# EAGLE schematic csa_ultrabus_v2 (EAGLE 6.4)

## Sheet 1 of 5: CS/A BUS
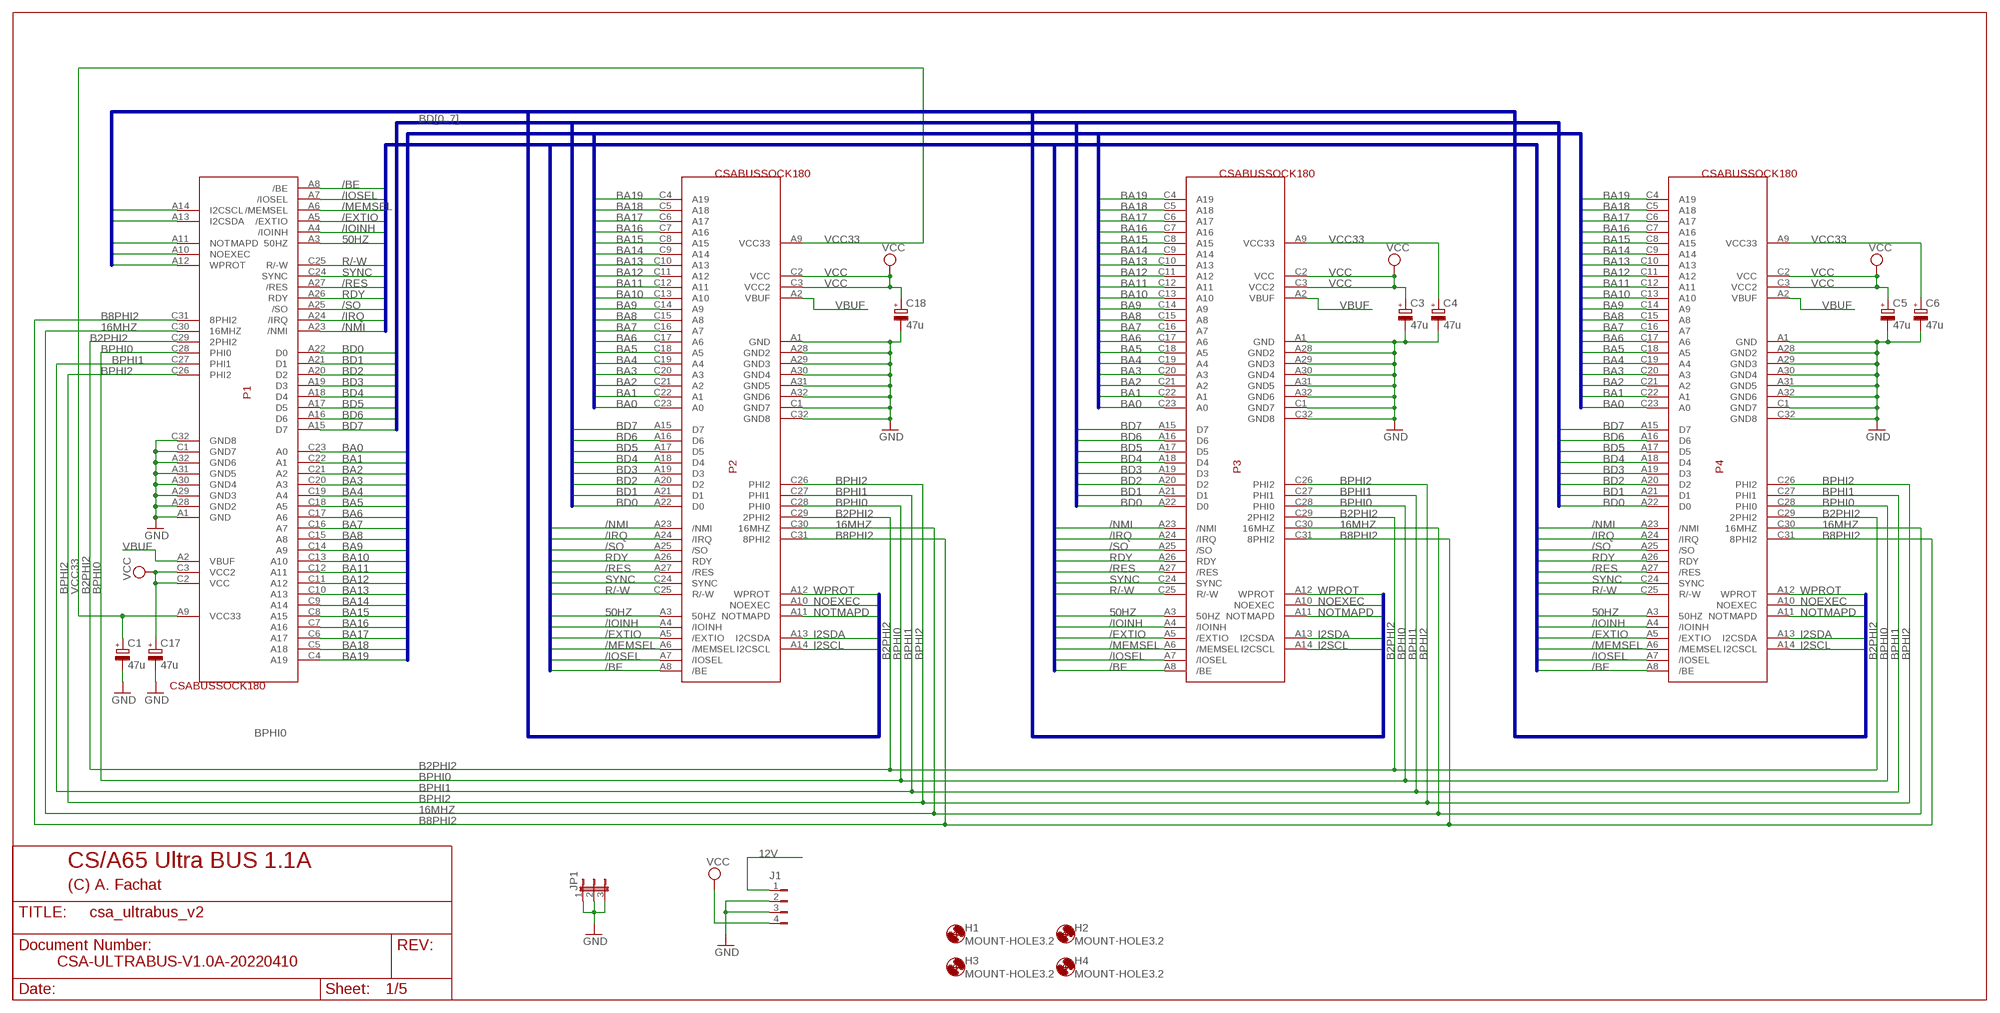
[diagram p0: schematic, sheet 1]

### Parts
C1  47u  CPOL-EUE2.5-5  [E2,5-5]
C3  47u  CPOL-EUE2.5-5  [E2,5-5]
C4  47u  CPOL-EUE2.5-5  [E2,5-5]
C5  47u  CPOL-EUE2.5-5  [E2,5-5]
C6  47u  CPOL-EUE2.5-5  [E2,5-5]
C17  47u  CPOL-EUE2.5-5  [E2,5-5]
C18  47u  CPOL-EUE2.5-5  [E2,5-5]
H1  MOUNT-HOLE3.2  [3,2]
H2  MOUNT-HOLE3.2  [3,2]
H3  MOUNT-HOLE3.2  [3,2]
H4  MOUNT-HOLE3.2  [3,2]
J1  FLOP-4W827001  [827001]
JP1  JP2E  [JP2]
P1  CSABUSSOCK180  [CSABUSSOCK180]
P2  CSABUSSOCK180  [CSABUSSOCK180]
P3  CSABUSSOCK180  [CSABUSSOCK180]
P4  CSABUSSOCK180  [CSABUSSOCK180]

### Nets
12V: J1.1 ; also sheet 2
16MHZ: P1.C30(16MHZ) P2.C30(16MHZ) P3.C30(16MHZ) P4.C30(16MHZ)
50HZ: P1.A3(50HZ) P2.A3(50HZ) P3.A3(50HZ) P4.A3(50HZ)
/BE: P1.A8(/BE) P2.A8(/BE) P3.A8(/BE) P4.A8(/BE) ; also sheet 2,5
/EXTIO: P1.A5(/EXTIO) P2.A5(/EXTIO) P3.A5(/EXTIO) P4.A5(/EXTIO)
/IOINH: P1.A4(/IOINH) P2.A4(/IOINH) P3.A4(/IOINH) P4.A4(/IOINH) ; also sheet 2
/IOSEL: P1.A7(/IOSEL) P2.A7(/IOSEL) P3.A7(/IOSEL) P4.A7(/IOSEL) ; also sheet 2,5
/IRQ: P1.A24(/IRQ) P2.A24(/IRQ) P3.A24(/IRQ) P4.A24(/IRQ) ; also sheet 2,3,4,5
/MEMSEL: P1.A6(/MEMSEL) P2.A6(/MEMSEL) P3.A6(/MEMSEL) P4.A6(/MEMSEL) ; also sheet 2,5
/NMI: P1.A23(/NMI) P2.A23(/NMI) P3.A23(/NMI) P4.A23(/NMI) ; also sheet 2,4,5
/RES: P1.A27(/RES) P2.A27(/RES) P3.A27(/RES) P4.A27(/RES) ; also sheet 2,3,4,5
/SO: P1.A25(/SO) P2.A25(/SO) P3.A25(/SO) P4.A25(/SO)
B2PHI2: P1.C29(2PHI2) P2.C29(2PHI2) P3.C29(2PHI2) P4.C29(2PHI2) ; also sheet 2,5
B8PHI2: P1.C31(8PHI2) P2.C31(8PHI2) P3.C31(8PHI2) P4.C31(8PHI2) ; also sheet 2,4,5
BA0: P1.C23(A0) P2.C23(A0) P3.C23(A0) P4.C23(A0) ; also sheet 2,3,4,5
BA1: P1.C22(A1) P2.C22(A1) P3.C22(A1) P4.C22(A1) ; also sheet 2,3,4,5
BA2: P1.C21(A2) P2.C21(A2) P3.C21(A2) P4.C21(A2) ; also sheet 2,3,4,5
BA3: P1.C20(A3) P2.C20(A3) P3.C20(A3) P4.C20(A3) ; also sheet 2,3,4,5
BA4: P1.C19(A4) P2.C19(A4) P3.C19(A4) P4.C19(A4) ; also sheet 2,3,4,5
BA5: P1.C18(A5) P2.C18(A5) P3.C18(A5) P4.C18(A5) ; also sheet 2,3,4,5
BA6: P1.C17(A6) P2.C17(A6) P3.C17(A6) P4.C17(A6) ; also sheet 2,3,4,5
BA7: P1.C16(A7) P2.C16(A7) P3.C16(A7) P4.C16(A7) ; also sheet 2,3,4,5
BA8: P1.C15(A8) P2.C15(A8) P3.C15(A8) P4.C15(A8) ; also sheet 2,3,4,5
BA9: P1.C14(A9) P2.C14(A9) P3.C14(A9) P4.C14(A9) ; also sheet 2,3,4,5
BA10: P1.C13(A10) P2.C13(A10) P3.C13(A10) P4.C13(A10) ; also sheet 2,3,4,5
BA11: P1.C12(A11) P2.C12(A11) P3.C12(A11) P4.C12(A11) ; also sheet 2,3,4,5
BA12: P1.C11(A12) P2.C11(A12) P3.C11(A12) P4.C11(A12) ; also sheet 2,3,4,5
BA13: P1.C10(A13) P2.C10(A13) P3.C10(A13) P4.C10(A13) ; also sheet 2,3,4,5
BA14: P1.C9(A14) P2.C9(A14) P3.C9(A14) P4.C9(A14) ; also sheet 2,3,4,5
BA15: P1.C8(A15) P2.C8(A15) P3.C8(A15) P4.C8(A15) ; also sheet 2,3,4,5
BA16: P1.C7(A16) P2.C7(A16) P3.C7(A16) P4.C7(A16) ; also sheet 2,5
BA17: P1.C6(A17) P2.C6(A17) P3.C6(A17) P4.C6(A17) ; also sheet 2,5
BA18: P1.C5(A18) P2.C5(A18) P3.C5(A18) P4.C5(A18) ; also sheet 2,5
BA19: P1.C4(A19) P2.C4(A19) P3.C4(A19) P4.C4(A19) ; also sheet 2,5
BD0: P1.A22(D0) P2.A22(D0) P3.A22(D0) P4.A22(D0) ; also sheet 2,3,4,5
BD1: P1.A21(D1) P2.A21(D1) P3.A21(D1) P4.A21(D1) ; also sheet 2,3,4,5
BD2: P1.A20(D2) P2.A20(D2) P3.A20(D2) P4.A20(D2) ; also sheet 2,3,4,5
BD3: P1.A19(D3) P2.A19(D3) P3.A19(D3) P4.A19(D3) ; also sheet 2,3,4,5
BD4: P1.A18(D4) P2.A18(D4) P3.A18(D4) P4.A18(D4) ; also sheet 2,3,4,5
BD5: P1.A17(D5) P2.A17(D5) P3.A17(D5) P4.A17(D5) ; also sheet 2,3,4,5
BD6: P1.A16(D6) P2.A16(D6) P3.A16(D6) P4.A16(D6) ; also sheet 2,3,4,5
BD7: P1.A15(D7) P2.A15(D7) P3.A15(D7) P4.A15(D7) ; also sheet 2,3,4,5
BPHI0: P1.C28(PHI0) P2.C28(PHI0) P3.C28(PHI0) P4.C28(PHI0) ; also sheet 5
BPHI1: P1.C27(PHI1) P2.C27(PHI1) P3.C27(PHI1) P4.C27(PHI1) ; also sheet 2,5
BPHI2: P1.C26(PHI2) P2.C26(PHI2) P3.C26(PHI2) P4.C26(PHI2) ; also sheet 2,3,4,5
GND: C1.- C3.- C4.- C5.- C6.- C17.- C18.- J1.2 J1.3 JP1.1 JP1.2 JP1.3 P1.A1(GND) P1.A28(GND2) P1.A29(GND3) P1.A30(GND4) P1.A31(GND5) P1.A32(GND6) P1.C1(GND7) P1.C32(GND8) P2.A1(GND) P2.A28(GND2) P2.A29(GND3) P2.A30(GND4) P2.A31(GND5) P2.A32(GND6) P2.C1(GND7) P2.C32(GND8) P3.A1(GND) P3.A28(GND2) P3.A29(GND3) P3.A30(GND4) P3.A31(GND5) P3.A32(GND6) P3.C1(GND7) P3.C32(GND8) P4.A1(GND) P4.A28(GND2) P4.A29(GND3) P4.A30(GND4) P4.A31(GND5) P4.A32(GND6) P4.C1(GND7) P4.C32(GND8) ; also sheet 2,3,4,5
I2SCL: P1.A14(I2CSCL) P2.A14(I2CSCL) P3.A14(I2CSCL) P4.A14(I2CSCL)
I2SDA: P1.A13(I2CSDA) P2.A13(I2CSDA) P3.A13(I2CSDA) P4.A13(I2CSDA)
NOEXEC: P1.A10(NOEXEC) P2.A10(NOEXEC) P3.A10(NOEXEC) P4.A10(NOEXEC)
NOTMAPD: P1.A11(NOTMAPD) P2.A11(NOTMAPD) P3.A11(NOTMAPD) P4.A11(NOTMAPD)
R/-W: P1.C25(R/-W) P2.C25(R/-W) P3.C25(R/-W) P4.C25(R/-W) ; also sheet 2,3,4,5
RDY: P1.A26(RDY) P2.A26(RDY) P3.A26(RDY) P4.A26(RDY) ; also sheet 2,5
SYNC: P1.C24(SYNC) P2.C24(SYNC) P3.C24(SYNC) P4.C24(SYNC) ; also sheet 2,3,5
VBUF: P1.A2(VBUF) P2.A2(VBUF) P3.A2(VBUF) P4.A2(VBUF) ; also sheet 5
VCC: C3.+ C5.+ C17.+ C18.+ J1.4 P1.C2(VCC) P1.C3(VCC2) P2.C2(VCC) P2.C3(VCC2) P3.C2(VCC) P3.C3(VCC2) P4.C2(VCC) P4.C3(VCC2) ; also sheet 2,3,4,5
VCC33: C1.+ C4.+ C6.+ P1.A9(VCC33) P2.A9(VCC33) P3.A9(VCC33) P4.A9(VCC33) ; also sheet 5
WPROT: P1.A12(WPROT) P2.A12(WPROT) P3.A12(WPROT) P4.A12(WPROT)

### Buses
BD[0..7]
BA[0..19]
/BE,/IOSEL,/MEMSEL,/EXTIO,/IOINH,50HZ,R/-W,SYNC,/RES,RDY,/SO,/IRQ,/NMI
I2SCL,I2SDA,NOTMAPD,NOEXEC,WPROT

### Notes on the sheet
- CS/A65 Ultra BUS 1.1A
- (C) A. Fachat
- CSA-ULTRABUS-V1.0A-20220410

## Sheet 2 of 5: Apple II Bus
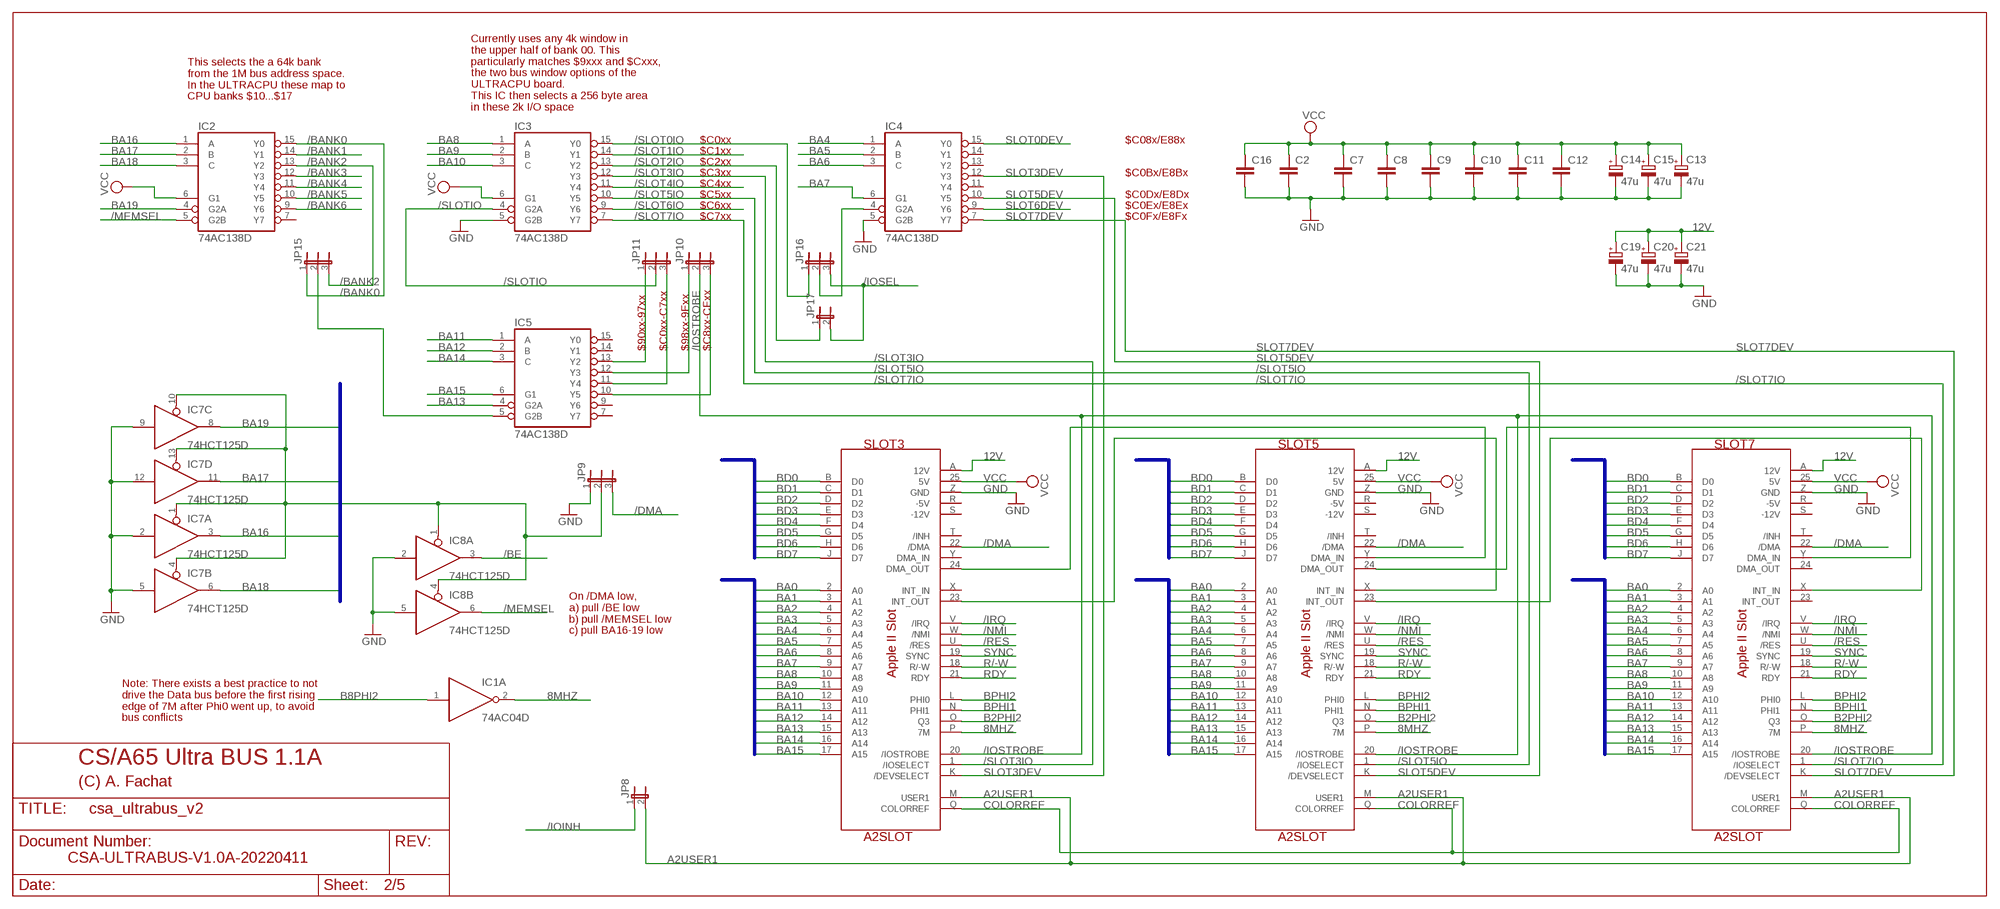
[diagram p1: schematic, sheet 2]

### Parts
C2  C-EUC0603  [C0603]
C7  C-EUC0603  [C0603]
C8  C-EUC0603  [C0603]
C9  C-EUC0603  [C0603]
C10  C-EUC0603  [C0603]
C11  C-EUC0603  [C0603]
C12  C-EUC0603  [C0603]
C13  47u  CPOL-EUE2.5-5  [E2,5-5]
C14  47u  CPOL-EUE2.5-5  [E2,5-5]
C15  47u  CPOL-EUE2.5-5  [E2,5-5]
C16  C-EUC0603  [C0603]
C19  47u  CPOL-EUE2.5-5  [E2,5-5]
C20  47u  CPOL-EUE2.5-5  [E2,5-5]
C21  47u  CPOL-EUE2.5-5  [E2,5-5]
IC1  74AC04D  [SO14]
IC2  74AC138D  [SO16]
IC3  74AC138D  [SO16]
IC4  74AC138D  [SO16]
IC5  74AC138D  [SO16]
IC7  74HCT125D  [SO14]
IC8  74HCT125D  [SO14]
JP8  JP1E  [JP1]
JP9  JP2E  [JP2]
JP10  JP2E  [JP2]
JP11  JP2E  [JP2]
JP15  JP2E  [JP2]
JP16  JP2E  [JP2]
JP17  JP1E  [JP1]
SLOT3  A2SLOT  [FE100-25]
SLOT5  A2SLOT  [FE100-25]
SLOT7  A2SLOT  [FE100-25]

### Nets
8MHZ: IC1.2(A:O) SLOT3.P(7M) SLOT5.P(7M) SLOT7.P(7M)
12V: C19.+ C20.+ C21.+ SLOT3.A(12V) SLOT5.A(12V) SLOT7.A(12V) ; also sheet 1
/BANK0: IC2.15(Y0) JP15.1 ; also sheet 3
/BANK1: IC2.14(Y1) ; also sheet 4
/BANK2: IC2.13(Y2) JP15.3
/BANK3: IC2.12(Y3) ; also sheet 4
/BANK4: IC2.11(Y4)
/BANK5: IC2.10(Y5)
/BANK6: IC2.9(Y6) ; also sheet 3
/BE: IC8.3(A:O) ; also sheet 1,5
/DMA: JP9.3 SLOT3.22(/DMA) SLOT5.22(/DMA) SLOT7.22(/DMA)
/IOINH: JP8.1 ; also sheet 1
/IOSEL: JP16.3 JP17.2 ; also sheet 1,5
/IOSTROBE: JP10.2 SLOT3.20(/IOSTROBE) SLOT5.20(/IOSTROBE) SLOT7.20(/IOSTROBE)
/IRQ: SLOT3.V(/IRQ) SLOT5.V(/IRQ) SLOT7.V(/IRQ) ; also sheet 1,3,4,5
/MEMSEL: IC2.5(G2B) IC8.6(B:O) ; also sheet 1,5
/NMI: SLOT3.W(/NMI) SLOT5.W(/NMI) SLOT7.W(/NMI) ; also sheet 1,4,5
/RES: SLOT3.U(/RES) SLOT5.U(/RES) SLOT7.U(/RES) ; also sheet 1,3,4,5
/SLOT0IO: IC3.15(Y0) JP16.1
/SLOT1IO: IC3.14(Y1) ; also sheet 4
/SLOT2IO: IC3.13(Y2) JP17.1
/SLOT3IO: IC3.12(Y3) SLOT3.1(/IOSELECT)
/SLOT4IO: IC3.11(Y4) ; also sheet 4
/SLOT5IO: IC3.10(Y5) SLOT5.1(/IOSELECT)
/SLOT6IO: IC3.9(Y6) ; also sheet 3
/SLOT7IO: IC3.7(Y7) SLOT7.1(/IOSELECT)
/SLOTIO: IC3.4(G2A) JP11.2
A2USER1: JP8.2 SLOT3.M(USER1) SLOT5.M(USER1) SLOT7.M(USER1)
B2PHI2: SLOT3.O(Q3) SLOT5.O(Q3) SLOT7.O(Q3) ; also sheet 1,5
B8PHI2: IC1.1(A:I) ; also sheet 1,4,5
BA0: SLOT3.2(A0) SLOT5.2(A0) SLOT7.2(A0) ; also sheet 1,3,4,5
BA1: SLOT3.3(A1) SLOT5.3(A1) SLOT7.3(A1) ; also sheet 1,3,4,5
BA2: SLOT3.4(A2) SLOT5.4(A2) SLOT7.4(A2) ; also sheet 1,3,4,5
BA3: SLOT3.5(A3) SLOT5.5(A3) SLOT7.5(A3) ; also sheet 1,3,4,5
BA4: IC4.1(A) SLOT3.6(A4) SLOT5.6(A4) SLOT7.6(A4) ; also sheet 1,3,4,5
BA5: IC4.2(B) SLOT3.7(A5) SLOT5.7(A5) SLOT7.7(A5) ; also sheet 1,3,4,5
BA6: IC4.3(C) SLOT3.8(A6) SLOT5.8(A6) SLOT7.8(A6) ; also sheet 1,3,4,5
BA7: IC4.6(G1) SLOT3.9(A7) SLOT5.9(A7) SLOT7.9(A7) ; also sheet 1,3,4,5
BA8: IC3.1(A) SLOT3.10(A8) SLOT5.10(A8) SLOT7.10(A8) ; also sheet 1,3,4,5
BA9: IC3.2(B) SLOT3.11(A9) SLOT5.11(A9) SLOT7.11(A9) ; also sheet 1,3,4,5
BA10: IC3.3(C) SLOT3.12(A10) SLOT5.12(A10) SLOT7.12(A10) ; also sheet 1,3,4,5
BA11: IC5.1(A) SLOT3.13(A11) SLOT5.13(A11) SLOT7.13(A11) ; also sheet 1,3,4,5
BA12: IC5.2(B) SLOT3.14(A12) SLOT5.14(A12) SLOT7.14(A12) ; also sheet 1,3,4,5
BA13: IC5.4(G2A) SLOT3.15(A13) SLOT5.15(A13) SLOT7.15(A13) ; also sheet 1,3,4,5
BA14: IC5.3(C) SLOT3.16(A14) SLOT5.16(A14) SLOT7.16(A14) ; also sheet 1,3,4,5
BA15: IC5.6(G1) SLOT3.17(A15) SLOT5.17(A15) SLOT7.17(A15) ; also sheet 1,3,4,5
BA16: IC2.1(A) IC7.3(A:O) ; also sheet 1,5
BA17: IC2.2(B) IC7.11(D:O) ; also sheet 1,5
BA18: IC2.3(C) IC7.6(B:O) ; also sheet 1,5
BA19: IC2.4(G2A) IC7.8(C:O) ; also sheet 1,5
BD0: SLOT3.B(D0) SLOT5.B(D0) SLOT7.B(D0) ; also sheet 1,3,4,5
BD1: SLOT3.C(D1) SLOT5.C(D1) SLOT7.C(D1) ; also sheet 1,3,4,5
BD2: SLOT3.D(D2) SLOT5.D(D2) SLOT7.D(D2) ; also sheet 1,3,4,5
BD3: SLOT3.E(D3) SLOT5.E(D3) SLOT7.E(D3) ; also sheet 1,3,4,5
BD4: SLOT3.F(D4) SLOT5.F(D4) SLOT7.F(D4) ; also sheet 1,3,4,5
BD5: SLOT3.G(D5) SLOT5.G(D5) SLOT7.G(D5) ; also sheet 1,3,4,5
BD6: SLOT3.H(D6) SLOT5.H(D6) SLOT7.H(D6) ; also sheet 1,3,4,5
BD7: SLOT3.J(D7) SLOT5.J(D7) SLOT7.J(D7) ; also sheet 1,3,4,5
BPHI1: SLOT3.N(PHI1) SLOT5.N(PHI1) SLOT7.N(PHI1) ; also sheet 1,5
BPHI2: SLOT3.L(PHI0) SLOT5.L(PHI0) SLOT7.L(PHI0) ; also sheet 1,3,4,5
COLORREF: SLOT3.Q(COLORREF) SLOT5.Q(COLORREF) SLOT7.Q(COLORREF)
GND: C2.2 C7.2 C8.2 C9.2 C10.2 C11.2 C12.2 C13.- C14.- C15.- C16.2 C19.- C20.- C21.- IC3.5(G2B) IC4.5(G2B) IC7.2(A:I) IC7.5(B:I) IC7.9(C:I) IC7.12(D:I) IC8.2(A:I) IC8.5(B:I) JP9.1 SLOT3.Z(GND) SLOT5.Z(GND) SLOT7.Z(GND) ; also sheet 1,3,4,5
N$3: IC7.1(A:OE) IC7.4(B:OE) IC7.10(C:OE) IC7.13(D:OE) IC8.1(A:OE) IC8.4(B:OE) JP9.2
N$11: SLOT3.23(INT_OUT) SLOT5.X(INT_IN)
N$12: SLOT5.23(INT_OUT) SLOT7.X(INT_IN)
N$13: SLOT3.24(DMA_OUT) SLOT5.Y(DMA_IN)
N$14: SLOT5.24(DMA_OUT) SLOT7.Y(DMA_IN)
N$16: IC5.13(Y2) JP11.1
N$17: IC5.12(Y3) JP10.1
N$18: IC5.11(Y4) JP11.3
N$19: IC5.10(Y5) JP10.3
N$20: IC4.4(G2A) JP16.2
N$21: IC5.5(G2B) JP15.2
R/-W: SLOT3.18(R/-W) SLOT5.18(R/-W) SLOT7.18(R/-W) ; also sheet 1,3,4,5
RDY: SLOT3.21(RDY) SLOT5.21(RDY) SLOT7.21(RDY) ; also sheet 1,5
SLOT0DEV: IC4.15(Y0)
SLOT3DEV: IC4.12(Y3) SLOT3.K(/DEVSELECT)
SLOT5DEV: IC4.10(Y5) SLOT5.K(/DEVSELECT)
SLOT6DEV: IC4.9(Y6)
SLOT7DEV: IC4.7(Y7) SLOT7.K(/DEVSELECT)
SYNC: SLOT3.19(SYNC) SLOT5.19(SYNC) SLOT7.19(SYNC) ; also sheet 1,3,5
VCC: C2.1 C7.1 C8.1 C9.1 C10.1 C11.1 C12.1 C13.+ C14.+ C15.+ C16.1 IC2.6(G1) IC3.6(G1) SLOT3.25(5V) SLOT5.25(5V) SLOT7.25(5V) ; also sheet 1,3,4,5
Unconnected: IC1.12(F:O) IC1.13(F:I) IC2.7(Y7) IC4.11(Y4) IC4.13(Y2) IC4.14(Y1) IC5.7(Y7) IC5.9(Y6) IC5.14(Y1) IC5.15(Y0) IC8.8(C:O) IC8.9(C:I) IC8.10(C:OE) IC8.11(D:O) IC8.12(D:I) IC8.13(D:OE) SLOT3.R(-5V) SLOT3.S(-12V) SLOT3.T(/INH) SLOT3.X(INT_IN) SLOT3.Y(DMA_IN) SLOT5.R(-5V) SLOT5.S(-12V) SLOT5.T(/INH) SLOT7.23(INT_OUT) SLOT7.24(DMA_OUT) SLOT7.R(-5V) SLOT7.S(-12V) SLOT7.T(/INH)

### Buses
BA[0..15]
BD[0..7]
BA[0..19]

### Notes on the sheet
- This selects the a 64k bank
  from the 1M bus address space.
  In the ULTRACPU these map to
  CPU banks $10...$17
- Currently uses any 4k window in 
  the upper half of bank 00. This
  particularly matches $9xxx and $Cxxx,
  the two bus window options of the
  ULTRACPU board.
  This IC then selects a 256 byte area
  in these 2k I/O space
- $C0xx | $C08x/E88x
- $C1xx
- $C2xx
- $C3xx | $C0Bx/E8Bx
- $C4xx
- $C5xx | $C0Dx/E8Dx
- $C6xx | $C0Ex/E8Ex
- $C7xx | $C0Fx/E8Fx
- $90xx-97xx | $C0xx-C7xx | $98xx-9Fxx | $C8xx-CFxx
- On /DMA low,
  a) pull /BE low
  b) pull /MEMSEL low
  c) pull BA16-19 low
- Note: There exists a best practice to not 
  drive the Data bus before the first rising 
  edge of 7M after Phi0 went up, to avoid 
  bus conflicts
- CS/A65 Ultra BUS 1.1A
- (C) A. Fachat
- CSA-ULTRABUS-V1.0A-20220411

## Sheet 3 of 5: RCxxxx
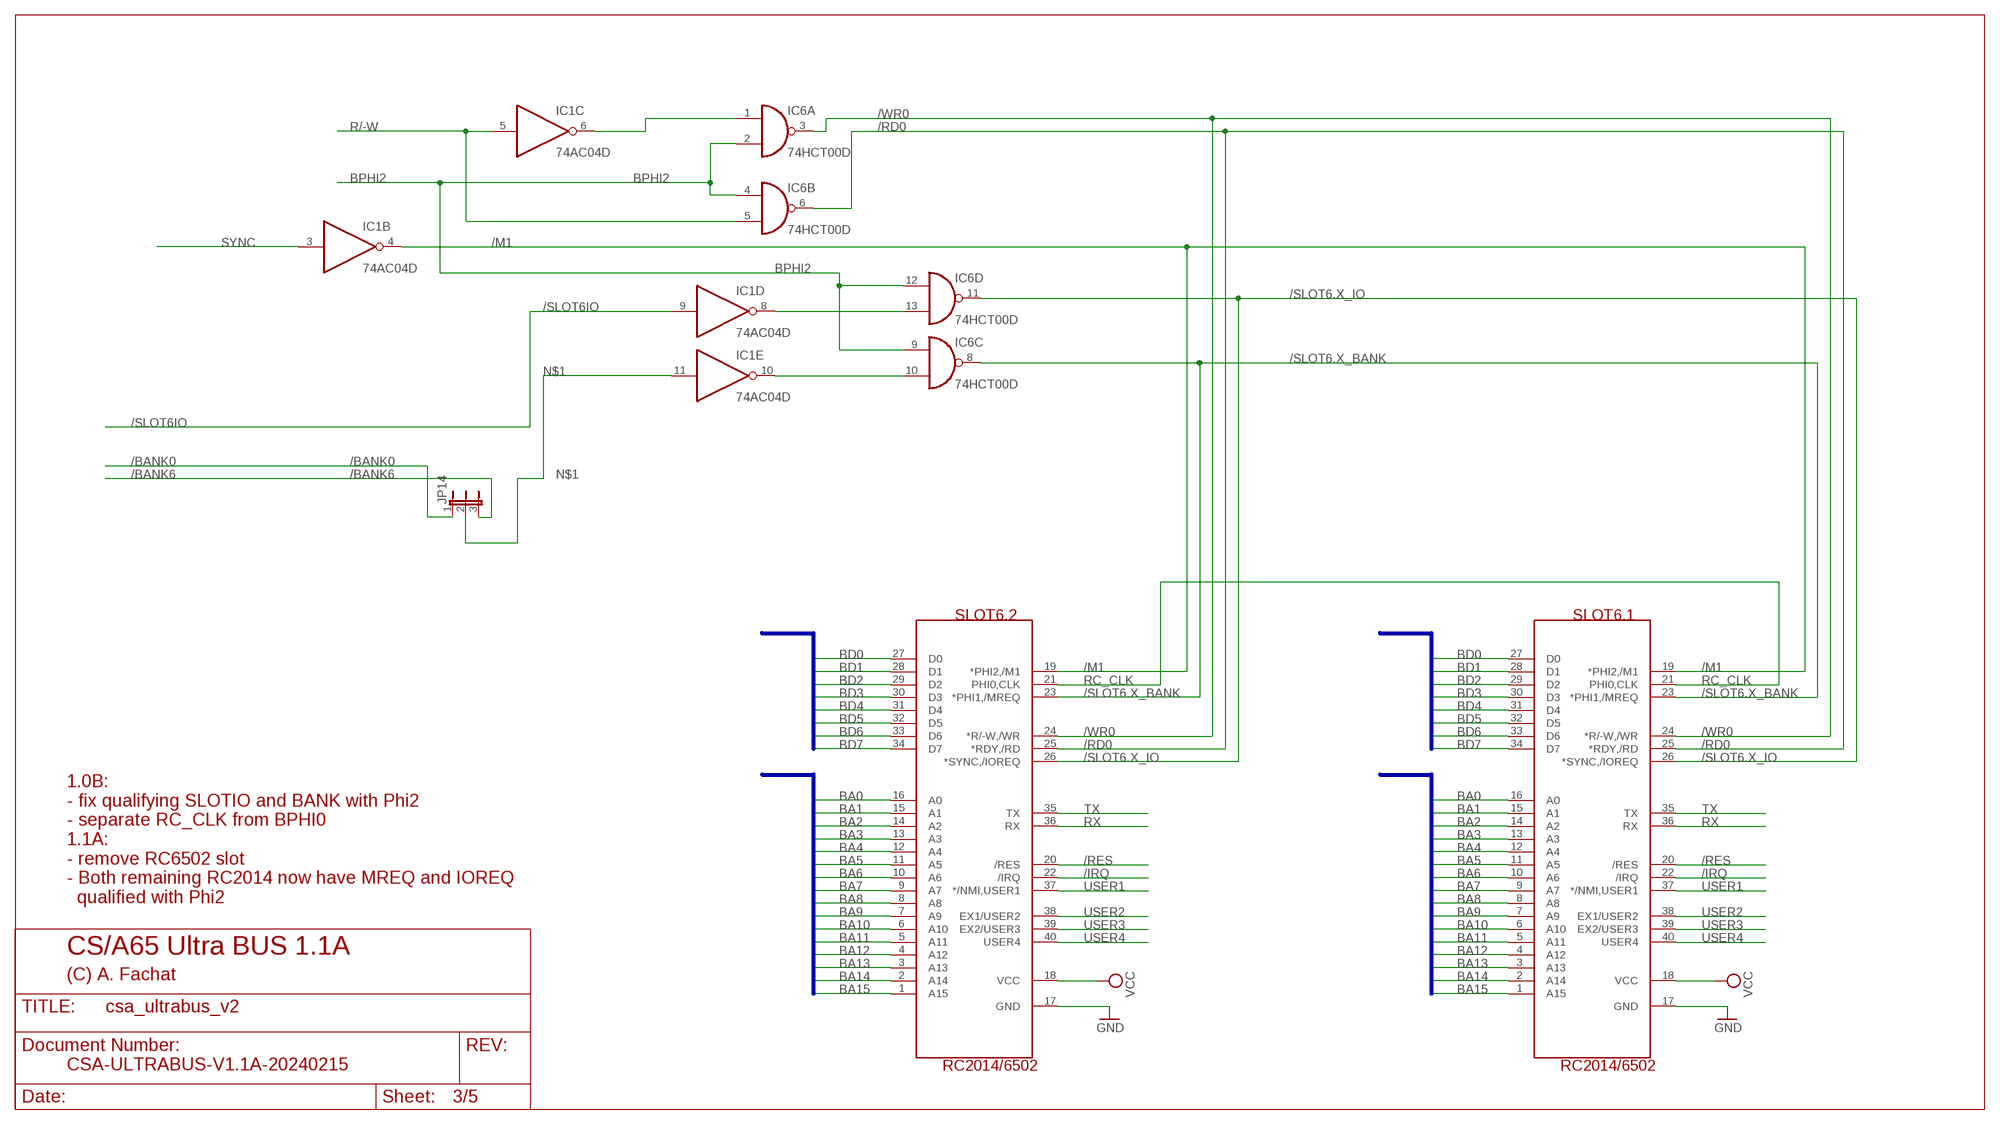
[diagram p2: schematic, sheet 3]

### Parts
IC6  74HCT00D  [SO14]
JP14  JP2E  [JP2]
SLOT6.1  RC2014/6502  [SIL40]
SLOT6.2  RC2014/6502  [SIL40]

### Nets
/BANK0: JP14.1 ; also sheet 2
/BANK6: JP14.3 ; also sheet 2
/IRQ: SLOT6.1.22(/IRQ) SLOT6.2.22(/IRQ) ; also sheet 1,2,4,5
/M1: IC1.4(B:O) SLOT6.1.19(*PHI2,/M1) SLOT6.2.19(*PHI2,/M1)
/RD0: IC6.6(B:O) SLOT6.1.25(*RDY,/RD) SLOT6.2.25(*RDY,/RD)
/RES: SLOT6.1.20(/RES) SLOT6.2.20(/RES) ; also sheet 1,2,4,5
/SLOT6.X_BANK: IC6.8(C:O) SLOT6.1.23(*PHI1,/MREQ) SLOT6.2.23(*PHI1,/MREQ)
/SLOT6.X_IO: IC6.11(D:O) SLOT6.1.26(*SYNC,/IOREQ) SLOT6.2.26(*SYNC,/IOREQ)
/SLOT6IO: IC1.9(D:I) ; also sheet 2
/WR0: IC6.3(A:O) SLOT6.1.24(*R/-W,/WR) SLOT6.2.24(*R/-W,/WR)
BA0: SLOT6.1.16(A0) SLOT6.2.16(A0) ; also sheet 1,2,4,5
BA1: SLOT6.1.15(A1) SLOT6.2.15(A1) ; also sheet 1,2,4,5
BA2: SLOT6.1.14(A2) SLOT6.2.14(A2) ; also sheet 1,2,4,5
BA3: SLOT6.1.13(A3) SLOT6.2.13(A3) ; also sheet 1,2,4,5
BA4: SLOT6.1.12(A4) SLOT6.2.12(A4) ; also sheet 1,2,4,5
BA5: SLOT6.1.11(A5) SLOT6.2.11(A5) ; also sheet 1,2,4,5
BA6: SLOT6.1.10(A6) SLOT6.2.10(A6) ; also sheet 1,2,4,5
BA7: SLOT6.1.9(A7) SLOT6.2.9(A7) ; also sheet 1,2,4,5
BA8: SLOT6.1.8(A8) SLOT6.2.8(A8) ; also sheet 1,2,4,5
BA9: SLOT6.1.7(A9) SLOT6.2.7(A9) ; also sheet 1,2,4,5
BA10: SLOT6.1.6(A10) SLOT6.2.6(A10) ; also sheet 1,2,4,5
BA11: SLOT6.1.5(A11) SLOT6.2.5(A11) ; also sheet 1,2,4,5
BA12: SLOT6.1.4(A12) SLOT6.2.4(A12) ; also sheet 1,2,4,5
BA13: SLOT6.1.3(A13) SLOT6.2.3(A13) ; also sheet 1,2,4,5
BA14: SLOT6.1.2(A14) SLOT6.2.2(A14) ; also sheet 1,2,4,5
BA15: SLOT6.1.1(A15) SLOT6.2.1(A15) ; also sheet 1,2,4,5
BD0: SLOT6.1.27(D0) SLOT6.2.27(D0) ; also sheet 1,2,4,5
BD1: SLOT6.1.28(D1) SLOT6.2.28(D1) ; also sheet 1,2,4,5
BD2: SLOT6.1.29(D2) SLOT6.2.29(D2) ; also sheet 1,2,4,5
BD3: SLOT6.1.30(D3) SLOT6.2.30(D3) ; also sheet 1,2,4,5
BD4: SLOT6.1.31(D4) SLOT6.2.31(D4) ; also sheet 1,2,4,5
BD5: SLOT6.1.32(D5) SLOT6.2.32(D5) ; also sheet 1,2,4,5
BD6: SLOT6.1.33(D6) SLOT6.2.33(D6) ; also sheet 1,2,4,5
BD7: SLOT6.1.34(D7) SLOT6.2.34(D7) ; also sheet 1,2,4,5
BPHI2: IC6.2(A:I1) IC6.4(B:I0) IC6.9(C:I0) IC6.12(D:I0) ; also sheet 1,2,4,5
GND: SLOT6.1.17(GND) SLOT6.2.17(GND) ; also sheet 1,2,4,5
N$1: IC1.11(E:I) JP14.2
N$5: IC1.8(D:O) IC6.13(D:I1)
N$8: IC1.6(C:O) IC6.1(A:I0)
N$9: IC1.10(E:O) IC6.10(C:I1)
R/-W: IC1.5(C:I) IC6.5(B:I1) ; also sheet 1,2,4,5
RC_CLK: SLOT6.1.21(PHI0,CLK) SLOT6.2.21(PHI0,CLK)
RX: SLOT6.1.36(RX) SLOT6.2.36(RX)
SYNC: IC1.3(B:I) ; also sheet 1,2,5
TX: SLOT6.1.35(TX) SLOT6.2.35(TX)
USER1: SLOT6.1.37(*/NMI,USER1) SLOT6.2.37(*/NMI,USER1)
USER2: SLOT6.1.38(EX1/USER2) SLOT6.2.38(EX1/USER2)
USER3: SLOT6.1.39(EX2/USER3) SLOT6.2.39(EX2/USER3)
USER4: SLOT6.1.40(USER4) SLOT6.2.40(USER4)
VCC: SLOT6.1.18(VCC) SLOT6.2.18(VCC) ; also sheet 1,2,4,5

### Buses
BD[0..7]
BA[0..15]

### Notes on the sheet
- 1.0B:
  - fix qualifying SLOTIO and BANK with Phi2
  - separate RC_CLK from BPHI0
  1.1A:
  - remove RC6502 slot
  - Both remaining RC2014 now have MREQ and IOREQ
    qualified with Phi2
- CS/A65 Ultra BUS 1.1A
- (C) A. Fachat
- CSA-ULTRABUS-V1.1A-20240215

## Sheet 4 of 5: C64
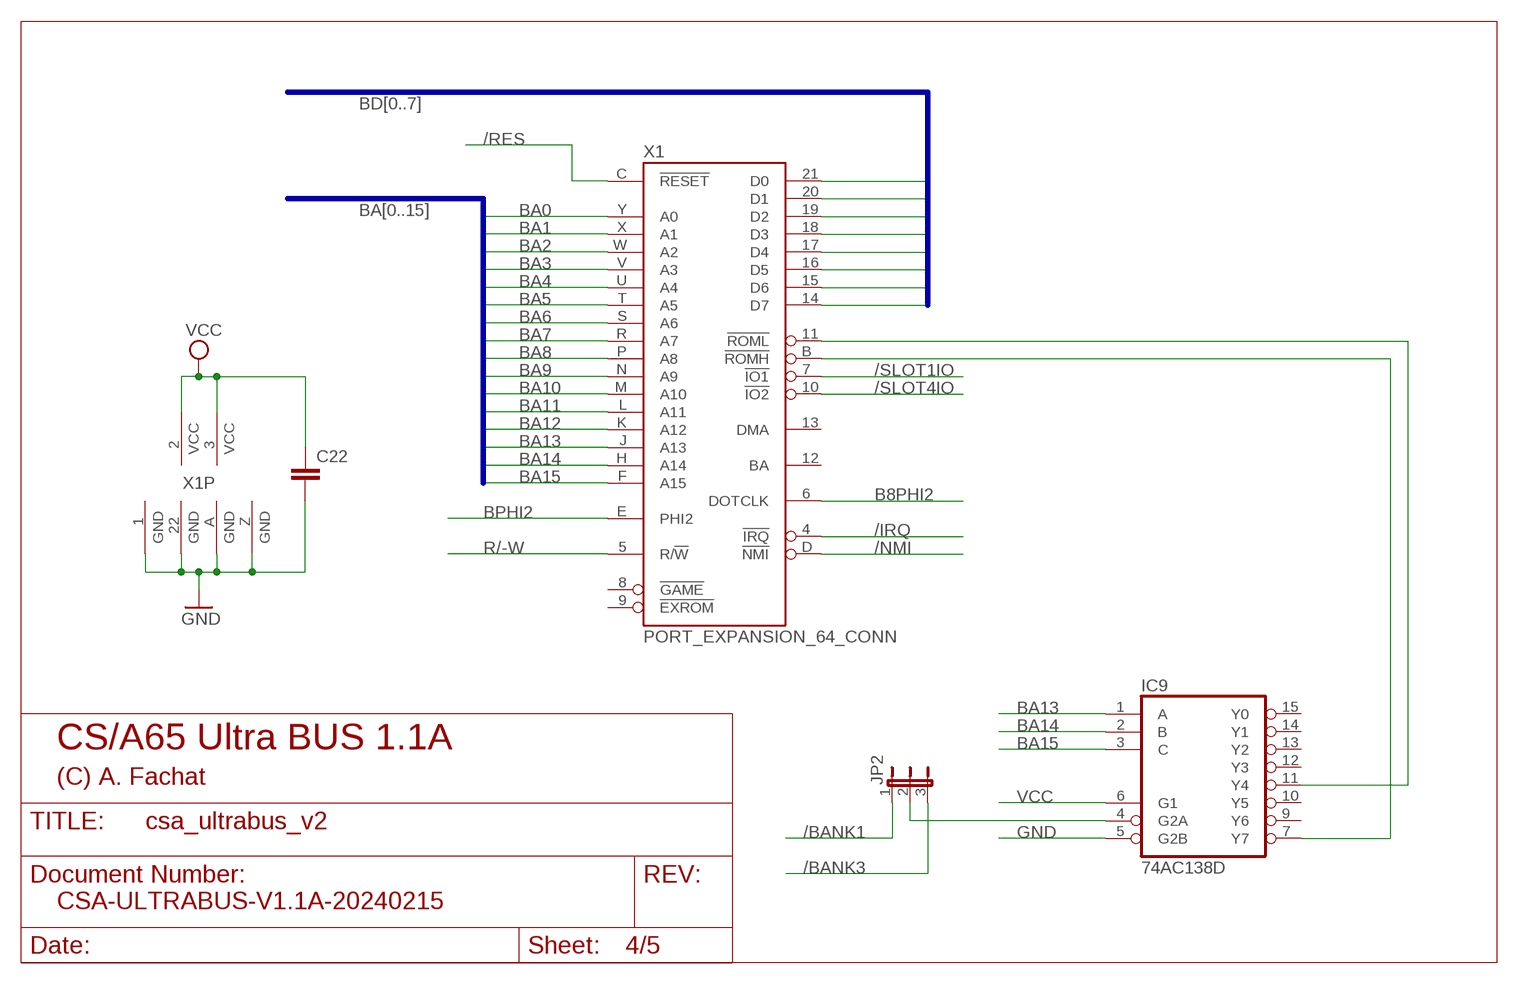
[diagram p3: schematic, sheet 4]

### Parts
C22  C-EUC0603  [C0603]
IC9  74AC138D  [SO16]
JP2  JP2E  [JP2]
X1  PORT_EXPANSION_64_CONN  [FE100-22-2]

### Nets
/BANK1: JP2.1 ; also sheet 2
/BANK3: JP2.3 ; also sheet 2
/IRQ: X1.4(!IRQ) ; also sheet 1,2,3,5
/NMI: X1.D(!NMI) ; also sheet 1,2,5
/RES: X1.C(!RESET) ; also sheet 1,2,3,5
/SLOT1IO: X1.7(!IO1) ; also sheet 2
/SLOT4IO: X1.10(!IO2) ; also sheet 2
B8PHI2: X1.6(DOTCLK) ; also sheet 1,2,5
BA0: X1.Y(A0) ; also sheet 1,2,3,5
BA1: X1.X(A1) ; also sheet 1,2,3,5
BA2: X1.W(A2) ; also sheet 1,2,3,5
BA3: X1.V(A3) ; also sheet 1,2,3,5
BA4: X1.U(A4) ; also sheet 1,2,3,5
BA5: X1.T(A5) ; also sheet 1,2,3,5
BA6: X1.S(A6) ; also sheet 1,2,3,5
BA7: X1.R(A7) ; also sheet 1,2,3,5
BA8: X1.P(A8) ; also sheet 1,2,3,5
BA9: X1.N(A9) ; also sheet 1,2,3,5
BA10: X1.M(A10) ; also sheet 1,2,3,5
BA11: X1.L(A11) ; also sheet 1,2,3,5
BA12: X1.K(A12) ; also sheet 1,2,3,5
BA13: IC9.1(A) X1.J(A13) ; also sheet 1,2,3,5
BA14: IC9.2(B) X1.H(A14) ; also sheet 1,2,3,5
BA15: IC9.3(C) X1.F(A15) ; also sheet 1,2,3,5
BD0: X1.21(D0) ; also sheet 1,2,3,5
BD1: X1.20(D1) ; also sheet 1,2,3,5
BD2: X1.19(D2) ; also sheet 1,2,3,5
BD3: X1.18(D3) ; also sheet 1,2,3,5
BD4: X1.17(D4) ; also sheet 1,2,3,5
BD5: X1.16(D5) ; also sheet 1,2,3,5
BD6: X1.15(D6) ; also sheet 1,2,3,5
BD7: X1.14(D7) ; also sheet 1,2,3,5
BPHI2: X1.E(PHI2) ; also sheet 1,2,3,5
GND: C22.2 IC9.5(G2B) X1.1(GND) X1.22(GND) X1.A(GND) X1.Z(GND) ; also sheet 1,2,3,5
N$6: IC9.7(Y7) X1.B(!ROMH)
N$7: IC9.11(Y4) X1.11(!ROML)
N$23: IC9.4(G2A) JP2.2
R/-W: X1.5(R/!W) ; also sheet 1,2,3,5
VCC: C22.1 IC9.6(G1) X1.2(VCC) X1.3(VCC) ; also sheet 1,2,3,5
Unconnected: IC9.9(Y6) IC9.10(Y5) IC9.12(Y3) IC9.13(Y2) IC9.14(Y1) IC9.15(Y0) X1.8(!GAME) X1.9(!EXROM) X1.12(BA) X1.13(DMA)

### Buses
BA[0..15]
BD[0..7]

### Notes on the sheet
- CS/A65 Ultra BUS 1.1A
- (C) A. Fachat
- CSA-ULTRABUS-V1.1A-20240215

## Sheet 5 of 5: Shortbus
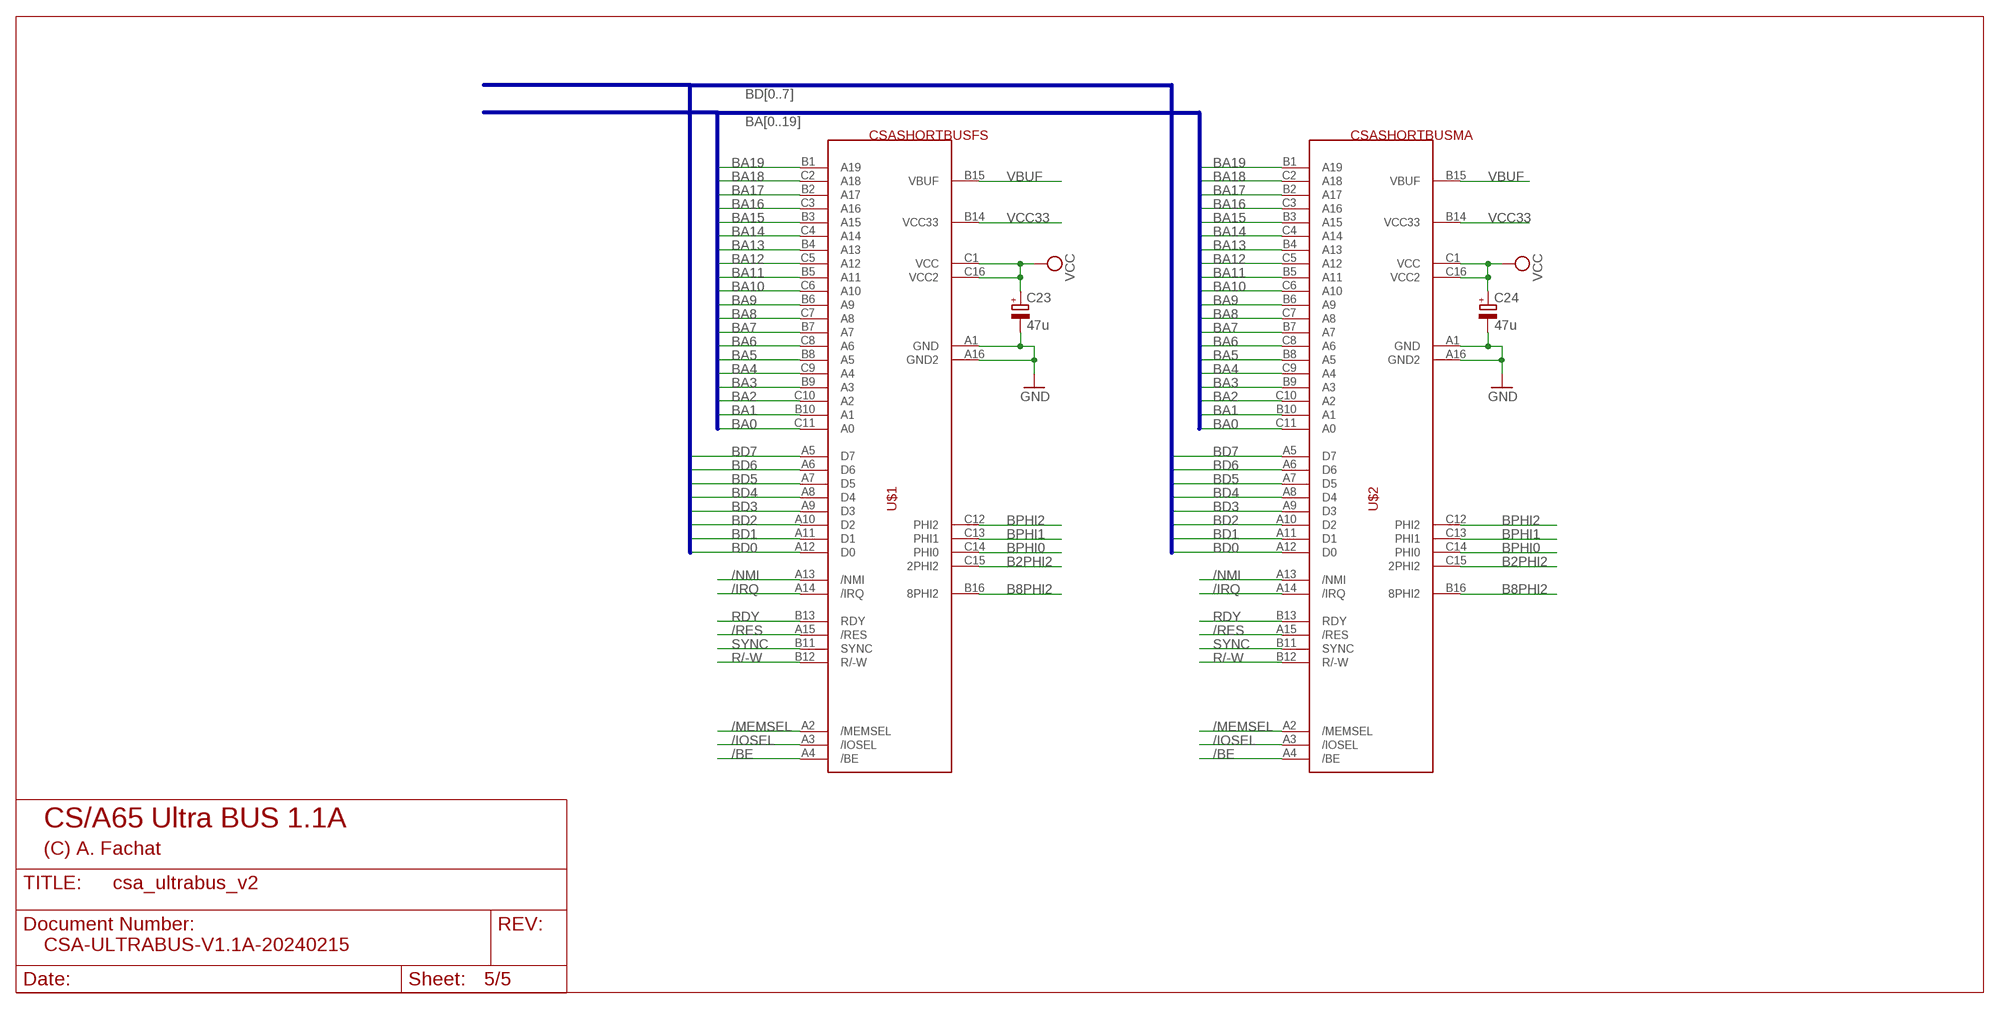
[diagram p4: schematic, sheet 5]

### Parts
C23  47u  CPOL-EUE2.5-5  [E2,5-5]
C24  47u  CPOL-EUE2.5-5  [E2,5-5]
U$1  CSASHORTBUSFS  [FABC48S2]
U$2  CSASHORTBUSMA  [MABC48B2]

### Nets
/BE: U$1.A4(/BE) U$2.A4(/BE) ; also sheet 1,2
/IOSEL: U$1.A3(/IOSEL) U$2.A3(/IOSEL) ; also sheet 1,2
/IRQ: U$1.A14(/IRQ) U$2.A14(/IRQ) ; also sheet 1,2,3,4
/MEMSEL: U$1.A2(/MEMSEL) U$2.A2(/MEMSEL) ; also sheet 1,2
/NMI: U$1.A13(/NMI) U$2.A13(/NMI) ; also sheet 1,2,4
/RES: U$1.A15(/RES) U$2.A15(/RES) ; also sheet 1,2,3,4
B2PHI2: U$1.C15(2PHI2) U$2.C15(2PHI2) ; also sheet 1,2
B8PHI2: U$1.B16(8PHI2) U$2.B16(8PHI2) ; also sheet 1,2,4
BA0: U$1.C11(A0) U$2.C11(A0) ; also sheet 1,2,3,4
BA1: U$1.B10(A1) U$2.B10(A1) ; also sheet 1,2,3,4
BA2: U$1.C10(A2) U$2.C10(A2) ; also sheet 1,2,3,4
BA3: U$1.B9(A3) U$2.B9(A3) ; also sheet 1,2,3,4
BA4: U$1.C9(A4) U$2.C9(A4) ; also sheet 1,2,3,4
BA5: U$1.B8(A5) U$2.B8(A5) ; also sheet 1,2,3,4
BA6: U$1.C8(A6) U$2.C8(A6) ; also sheet 1,2,3,4
BA7: U$1.B7(A7) U$2.B7(A7) ; also sheet 1,2,3,4
BA8: U$1.C7(A8) U$2.C7(A8) ; also sheet 1,2,3,4
BA9: U$1.B6(A9) U$2.B6(A9) ; also sheet 1,2,3,4
BA10: U$1.C6(A10) U$2.C6(A10) ; also sheet 1,2,3,4
BA11: U$1.B5(A11) U$2.B5(A11) ; also sheet 1,2,3,4
BA12: U$1.C5(A12) U$2.C5(A12) ; also sheet 1,2,3,4
BA13: U$1.B4(A13) U$2.B4(A13) ; also sheet 1,2,3,4
BA14: U$1.C4(A14) U$2.C4(A14) ; also sheet 1,2,3,4
BA15: U$1.B3(A15) U$2.B3(A15) ; also sheet 1,2,3,4
BA16: U$1.C3(A16) U$2.C3(A16) ; also sheet 1,2
BA17: U$1.B2(A17) U$2.B2(A17) ; also sheet 1,2
BA18: U$1.C2(A18) U$2.C2(A18) ; also sheet 1,2
BA19: U$1.B1(A19) U$2.B1(A19) ; also sheet 1,2
BD0: U$1.A12(D0) U$2.A12(D0) ; also sheet 1,2,3,4
BD1: U$1.A11(D1) U$2.A11(D1) ; also sheet 1,2,3,4
BD2: U$1.A10(D2) U$2.A10(D2) ; also sheet 1,2,3,4
BD3: U$1.A9(D3) U$2.A9(D3) ; also sheet 1,2,3,4
BD4: U$1.A8(D4) U$2.A8(D4) ; also sheet 1,2,3,4
BD5: U$1.A7(D5) U$2.A7(D5) ; also sheet 1,2,3,4
BD6: U$1.A6(D6) U$2.A6(D6) ; also sheet 1,2,3,4
BD7: U$1.A5(D7) U$2.A5(D7) ; also sheet 1,2,3,4
BPHI0: U$1.C14(PHI0) U$2.C14(PHI0) ; also sheet 1
BPHI1: U$1.C13(PHI1) U$2.C13(PHI1) ; also sheet 1,2
BPHI2: U$1.C12(PHI2) U$2.C12(PHI2) ; also sheet 1,2,3,4
GND: C23.- C24.- U$1.A1(GND) U$1.A16(GND2) U$2.A1(GND) U$2.A16(GND2) ; also sheet 1,2,3,4
R/-W: U$1.B12(R/-W) U$2.B12(R/-W) ; also sheet 1,2,3,4
RDY: U$1.B13(RDY) U$2.B13(RDY) ; also sheet 1,2
SYNC: U$1.B11(SYNC) U$2.B11(SYNC) ; also sheet 1,2,3
VBUF: U$1.B15(VBUF) U$2.B15(VBUF) ; also sheet 1
VCC: C23.+ C24.+ U$1.C1(VCC) U$1.C16(VCC2) U$2.C1(VCC) U$2.C16(VCC2) ; also sheet 1,2,3,4
VCC33: U$1.B14(VCC33) U$2.B14(VCC33) ; also sheet 1

### Buses
BA[0..19]
BD[0..7]

### Notes on the sheet
- CS/A65 Ultra BUS 1.1A
- (C) A. Fachat
- CSA-ULTRABUS-V1.1A-20240215

## Power pins joined to a net without a drawn wire
GND: IC1.7(P:GND) IC2.8(GND) IC3.8(GND) IC4.8(GND) IC5.8(GND) IC6.7(P:GND) IC7.7(P:GND) IC8.7(P:GND) IC9.8(GND)
VCC: IC1.14(P:VCC) IC2.16(VCC) IC3.16(VCC) IC4.16(VCC) IC5.16(VCC) IC6.14(P:VCC) IC7.14(P:VCC) IC8.14(P:VCC) IC9.16(VCC)

## Library data of the parts
C1 C3-C6 C13-C15 C17-C21 C23 C24 = rcl:CPOL-EU: POLARIZED CAPACITOR, European symbol
C2 C7-C12 C16 C22 = rcl:C-EU: CAPACITOR, European symbol
H1-H4 = holes:MOUNT-HOLE: MOUNTING HOLE with drill center marker
IC1 = 74xx-eu:74*04: Hex INVERTER
IC2-IC5 IC9 = 74xx-eu:74*138: 3-line to 8-line DECODER/DEMULTIPLEXER
IC6 = 74xx-eu:74*00: Quad 2-input NAND gate
IC7 IC8 = 74xx-eu:74*125: Quad bus BUFFER, 3-state
J1 = con-amp:FLOP-4W: MATE N-LOCK Floppy / HDD conector Distributor: Bürklin 71F972
JP1 JP2 JP9-JP11 JP14-JP16 = jumper:JP2E: JUMPER
JP8 JP17 = jumper:JP1E: JUMPER
P1-P4 = csa:CSABUS
SLOT3 SLOT5 SLOT7 = csa:A2SLOT
SLOT6.1 SLOT6.2 = csa:RC2014/6502
U$1 U$2 = csa:CSASHORTBUS
X1 = commodore:PORT_EXPANSION_64_CONN